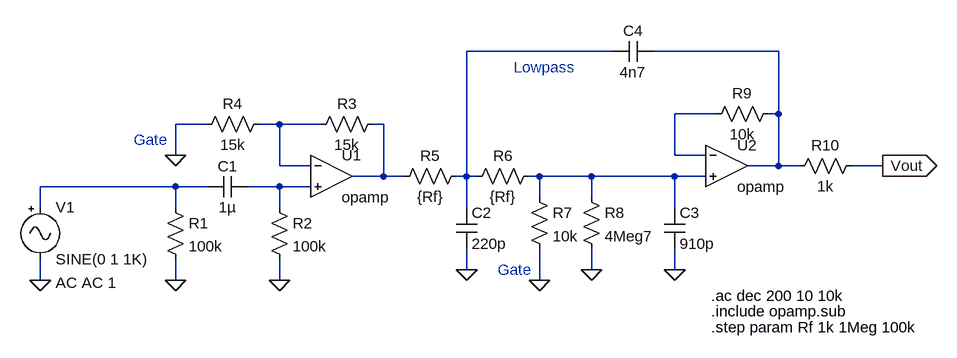
[diagram p0: schematic Buchla.asc]
Buchla.asc, the LTspice schematic file:
Version 4
SHEET 1 1360 680
WIRE 832 -64 608 -64
WIRE 1088 -64 896 -64
WIRE 992 32 928 32
WIRE 1088 32 1088 -64
WIRE 1088 32 1072 32
WIRE 208 48 160 48
WIRE 320 48 288 48
WIRE 384 48 320 48
WIRE 480 48 464 48
WIRE 160 96 160 48
WIRE 928 96 928 32
WIRE 976 96 928 96
WIRE 320 112 320 48
WIRE 368 112 320 112
WIRE 1088 112 1088 32
WIRE 1088 112 1040 112
WIRE 1120 112 1088 112
WIRE 1248 112 1200 112
WIRE 480 128 480 48
WIRE 480 128 432 128
WIRE 512 128 480 128
WIRE 608 128 608 -64
WIRE 608 128 592 128
WIRE 624 128 608 128
WIRE 720 128 704 128
WIRE 800 128 720 128
WIRE 928 128 800 128
WIRE 976 128 928 128
WIRE 160 144 -48 144
WIRE 208 144 160 144
WIRE 320 144 272 144
WIRE 368 144 320 144
WIRE 720 160 720 128
WIRE 800 160 800 128
WIRE -48 176 -48 144
WIRE 160 176 160 144
WIRE 320 176 320 144
WIRE 608 176 608 128
WIRE 928 176 928 128
WIRE 608 272 608 240
WIRE 800 272 800 240
WIRE 928 272 928 240
WIRE -48 288 -48 256
WIRE 160 288 160 256
WIRE 320 288 320 256
WIRE 720 288 720 240
FLAG -48 288 0
FLAG 160 288 0
FLAG 320 288 0
FLAG 608 272 0
FLAG 720 288 0
FLAG 800 272 0
FLAG 928 272 0
FLAG 1248 112 Vout
IOPIN 1248 112 Out
FLAG 160 96 0
SYMBOL Misc\\signal -48 160 R0
WINDOW 123 24 132 Left 2
WINDOW 39 0 0 Left 0
SYMATTR Value2 AC AC 1
SYMATTR InstName V1
SYMBOL res 144 160 R0
SYMATTR InstName R1
SYMATTR Value 100k
SYMBOL cap 272 128 R90
WINDOW 0 0 32 VBottom 2
WINDOW 3 32 32 VTop 2
SYMATTR InstName C1
SYMATTR Value 1µ
SYMBOL res 304 160 R0
SYMATTR InstName R2
SYMATTR Value 100k
SYMBOL OpAmps\\opamp 400 64 R0
SYMATTR InstName U1
SYMBOL res 480 32 R90
WINDOW 0 0 56 VBottom 2
WINDOW 3 32 56 VTop 2
SYMATTR InstName R3
SYMATTR Value 15k
SYMBOL res 304 32 R90
WINDOW 0 0 56 VBottom 2
WINDOW 3 32 56 VTop 2
SYMATTR InstName R4
SYMATTR Value 15k
SYMBOL res 608 112 R90
WINDOW 0 0 56 VBottom 2
WINDOW 3 32 56 VTop 2
SYMATTR InstName R5
SYMATTR Value {Rf}
SYMBOL res 720 112 R90
WINDOW 0 0 56 VBottom 2
WINDOW 3 32 56 VTop 2
SYMATTR InstName R6
SYMATTR Value {Rf}
SYMBOL cap 592 176 R0
SYMATTR InstName C2
SYMATTR Value 220p
SYMBOL res 704 144 R0
SYMATTR InstName R7
SYMATTR Value 10k
SYMBOL res 784 144 R0
SYMATTR InstName R8
SYMATTR Value 4Meg7
SYMBOL cap 912 176 R0
SYMATTR InstName C3
SYMATTR Value 910p
SYMBOL OpAmps\\opamp 1008 48 R0
SYMATTR InstName U2
SYMBOL res 1088 16 R90
WINDOW 0 0 56 VBottom 2
WINDOW 3 32 56 VTop 2
SYMATTR InstName R9
SYMATTR Value 10k
SYMBOL cap 896 -80 R90
WINDOW 0 0 32 VBottom 2
WINDOW 3 32 32 VTop 2
SYMATTR InstName C4
SYMATTR Value 4n7
SYMBOL res 1216 96 R90
WINDOW 0 0 56 VBottom 2
WINDOW 3 32 56 VTop 2
SYMATTR InstName R10
SYMATTR Value 1k
TEXT 984 312 Left 2 !.ac dec 200 10 10k
TEXT 984 336 Left 2 !.include opamp.sub
TEXT 96 72 Left 2 ;Gate
TEXT 656 272 Left 2 ;Gate
TEXT 680 -40 Left 2 ;Lowpass
TEXT 984 360 Left 2 !.step param Rf 1k 1Meg 100k

The netlist it stands for:
* Buchla.asc
V1 N007 0 SINE(0 1 1K) AC AC 1
R1 N007 0 100k
C1 N008 N007 1µ
R2 N008 0 100k
XU1 N004 N008 N005 opamp Aol=100K GBW=10Meg  ; pins invin noninvin out
R3 N005 N004 15k
R4 N004 0 15k
R5 N001 N005 {Rf}
R6 N006 N001 {Rf}
C2 N001 0 220p
R7 N006 0 10k
R8 N006 0 4Meg7
C3 N006 0 910p
XU2 N003 N006 N002 opamp Aol=100K GBW=10Meg  ; pins invin noninvin out
R9 N002 N003 10k
C4 N002 N001 4n7
R10 Vout N002 1k
.ac dec 200 10 10k
.include opamp.sub
* Gate
* Gate
* Lowpass
.step param Rf 1k 1Meg 100k
.backanno
.end